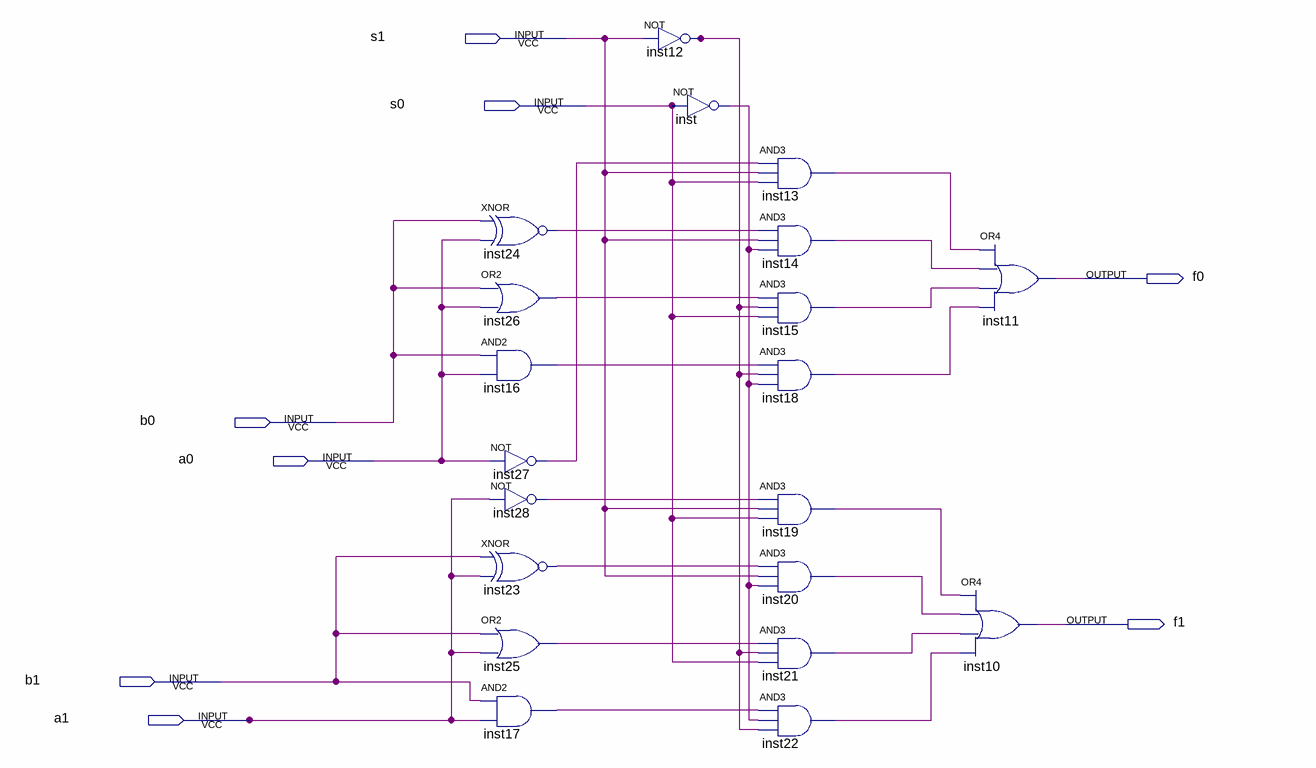
[diagram p0: schematic sheet]
// Quartus schematic SelectorCircuit.bdf as structural Verilog: 20 symbols, 8 pins
module SelectorCircuit (
  input  s1,
  input  s0,
  input  b0,
  input  a0,
  input  b1,
  input  a1,
  output f0,
  output f1
);

  wire inst12_out, inst13_out, inst14_out, inst15_out, inst16_out, inst17_out, inst18_out, inst19_out,
       inst20_out, inst21_out, inst22_out, inst23_out, inst24_out, inst25_out, inst26_out, inst27_out,
       inst28_out, inst_out;

  xnor inst24 (inst24_out, b0, a0);
  or inst26 (inst26_out, b0, a0);
  and inst16 (inst16_out, b0, a0);
  not inst27 (inst27_out, a0);
  not inst28 (inst28_out, a1);
  xnor inst23 (inst23_out, b1, a1);
  or inst25 (inst25_out, b1, a1);
  and inst17 (inst17_out, b1, a1);
  not inst12 (inst12_out, s1);
  not inst (inst_out, s0);
  and inst13 (inst13_out, inst27_out, s1, s0);
  and inst14 (inst14_out, inst24_out, s1, inst_out);
  and inst15 (inst15_out, inst26_out, inst12_out, s0);
  and inst18 (inst18_out, inst16_out, inst12_out, inst_out);
  and inst19 (inst19_out, inst28_out, s1, s0);
  and inst20 (inst20_out, inst23_out, s1, inst_out);
  and inst21 (inst21_out, inst25_out, inst12_out, s0);
  and inst22 (inst22_out, inst17_out, inst_out, inst12_out);
  or inst11 (f0, inst13_out, inst14_out, inst15_out, inst18_out);
  or inst10 (f1, inst19_out, inst20_out, inst21_out, inst22_out);
endmodule
